# EAGLE design forcefoot (EAGLE 6.1)
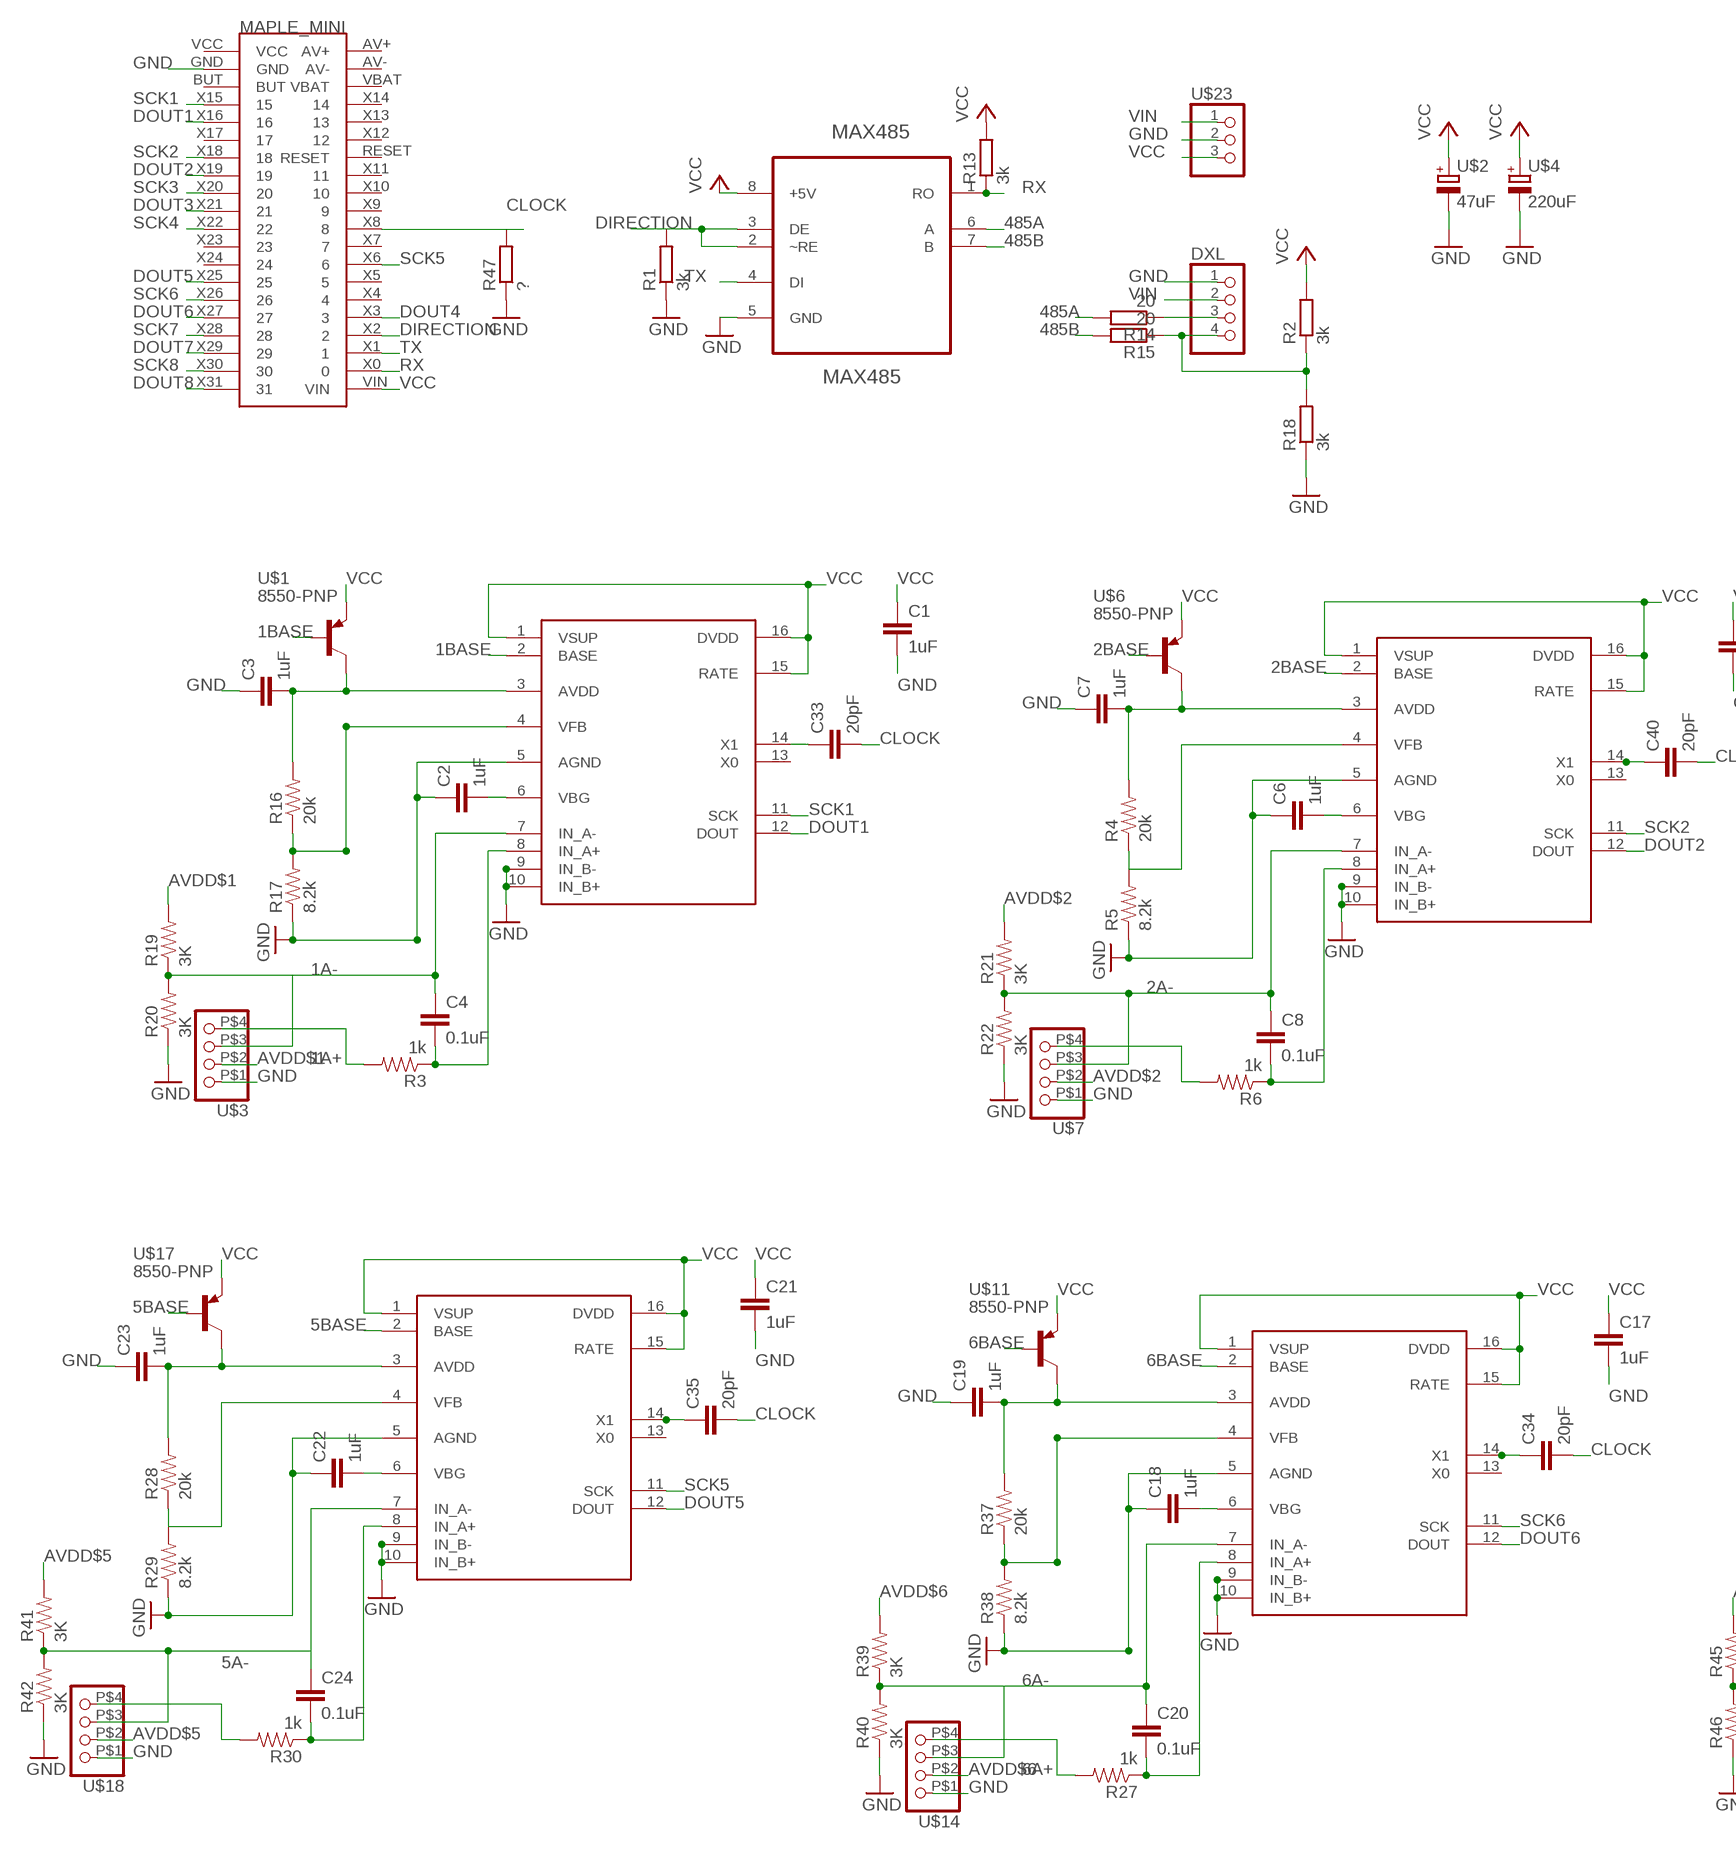
[diagram p0: schematic, sheet 1, part 1 of 2]
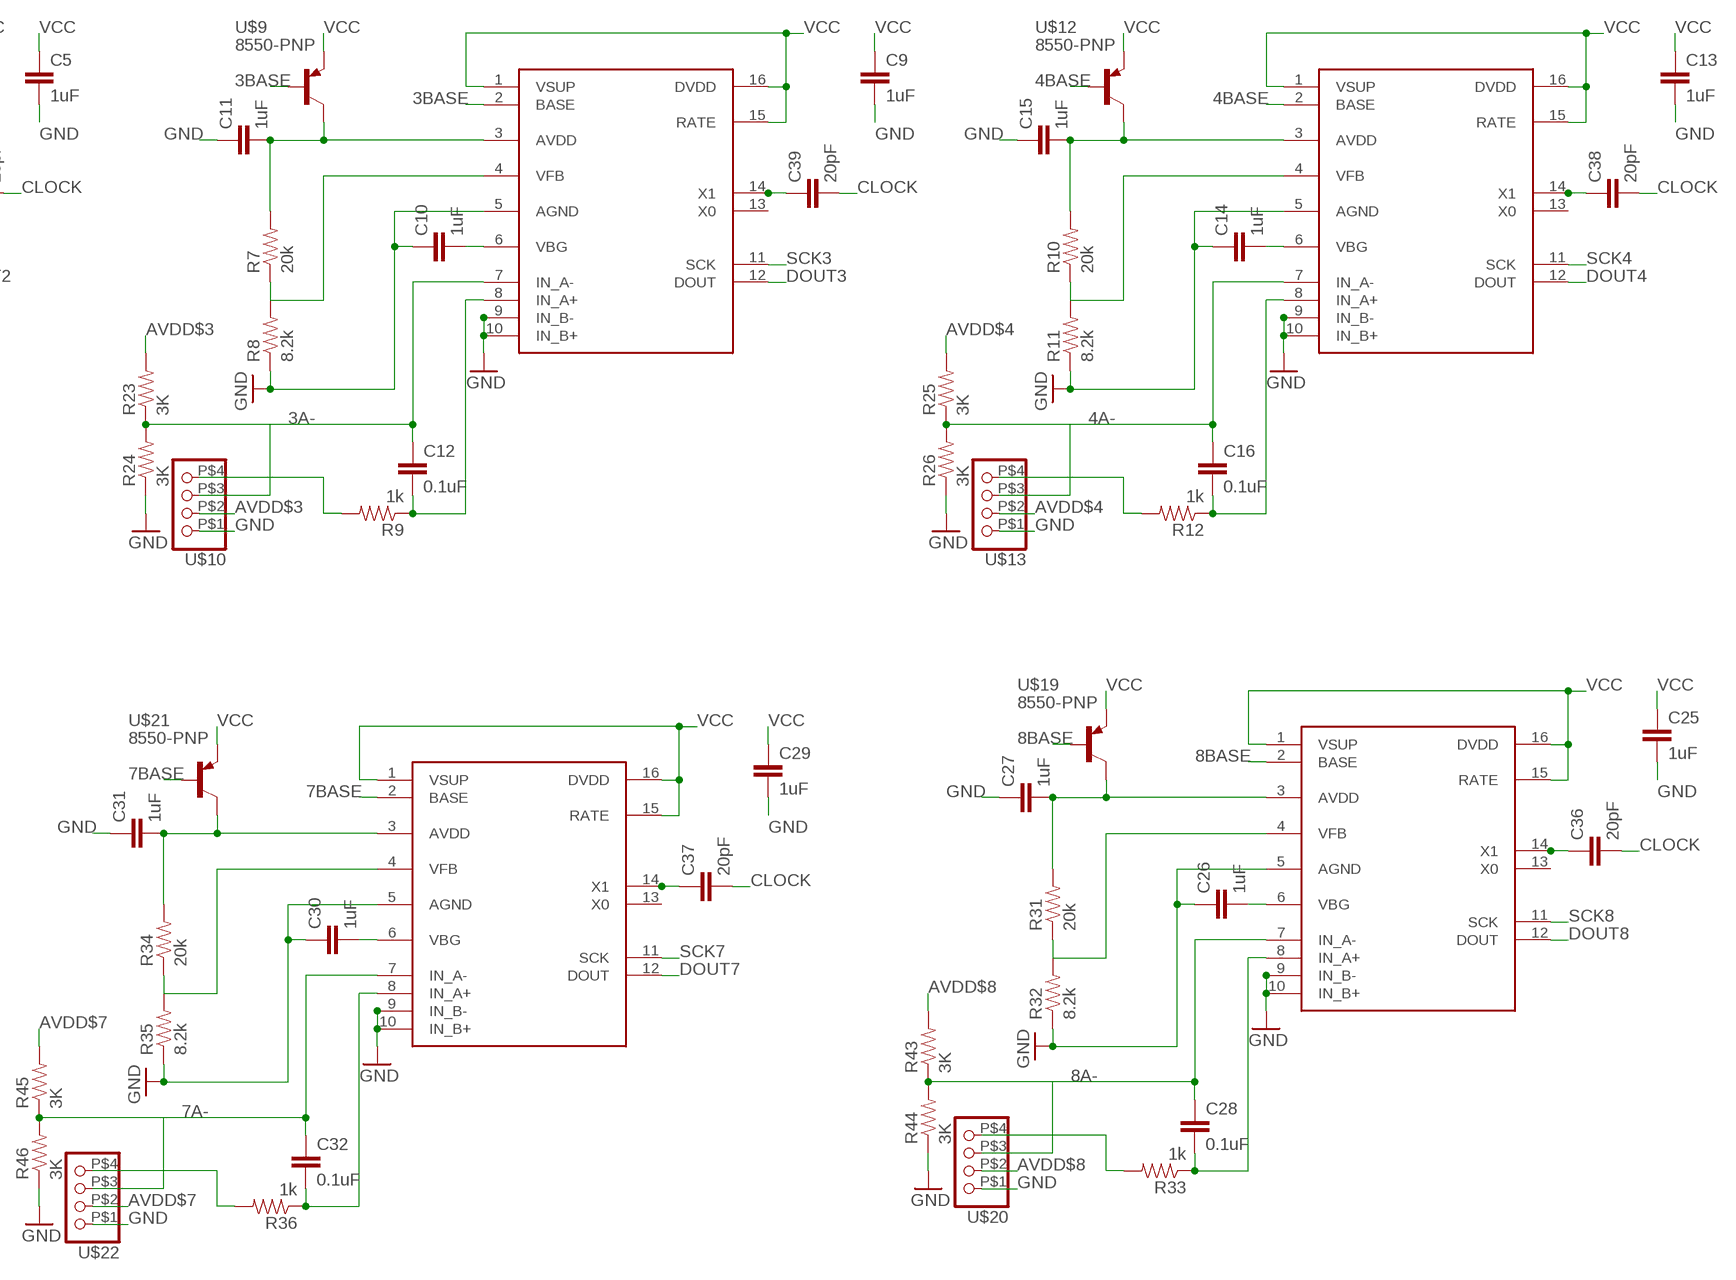
[diagram p1: schematic, sheet 1, part 2 of 2]

## Parts
C1  1uF  CAP0805  [0805]
C2  1uF  CAP0805  [0805]
C3  1uF  CAP0805  [0805]
C4  0.1uF  CAP0805  [0805]
C5  1uF  CAP0805  [0805]
C6  1uF  CAP0805  [0805]
C7  1uF  CAP0805  [0805]
C8  0.1uF  CAP0805  [0805]
C9  1uF  CAP0805  [0805]
C10  1uF  CAP0805  [0805]
C11  1uF  CAP0805  [0805]
C12  0.1uF  CAP0805  [0805]
C13  1uF  CAP0805  [0805]
C14  1uF  CAP0805  [0805]
C15  1uF  CAP0805  [0805]
C16  0.1uF  CAP0805  [0805]
C17  1uF  CAP0805  [0805]
C18  1uF  CAP0805  [0805]
C19  1uF  CAP0805  [0805]
C20  0.1uF  CAP0805  [0805]
C21  1uF  CAP0805  [0805]
C22  1uF  CAP0805  [0805]
C23  1uF  CAP0805  [0805]
C24  0.1uF  CAP0805  [0805]
C25  1uF  CAP0805  [0805]
C26  1uF  CAP0805  [0805]
C27  1uF  CAP0805  [0805]
C28  0.1uF  CAP0805  [0805]
C29  1uF  CAP0805  [0805]
C30  1uF  CAP0805  [0805]
C31  1uF  CAP0805  [0805]
C32  0.1uF  CAP0805  [0805]
C33  20pF  CAP0805  [0805]
C34  20pF  CAP0805  [0805]
C35  20pF  CAP0805  [0805]
C36  20pF  CAP0805  [0805]
C37  20pF  CAP0805  [0805]
C38  20pF  CAP0805  [0805]
C39  20pF  CAP0805  [0805]
C40  20pF  CAP0805  [0805]
DXL  CONNEC_1X04"  [CONNEC_1X04]
HX1  HX711SO16  [SO16]
HX2  HX711SO16  [SO16]
HX3  HX711SO16  [SO16]
HX4  HX711SO16  [SO16]
HX5  HX711SO16  [SO16]
HX6  HX711SO16  [SO16]
HX7  HX711SO16  [SO16]
HX8  HX711SO16  [SO16]
MAPLE_MINI  MAPLE_MINI  [CONNEC_2X20]
MAX485  MAX485  [SO8]
R1  3k  RESISTANCE-R0805  [R0805]
R2  3k  RESISTANCE-R0805  [R0805]
R3  1k  RESISTOR0805-RES  [0805]
R4  20k  RESISTOR0805-RES  [0805]
R5  8.2k  RESISTOR0805-RES  [0805]
R6  1k  RESISTOR0805-RES  [0805]
R7  20k  RESISTOR0805-RES  [0805]
R8  8.2k  RESISTOR0805-RES  [0805]
R9  1k  RESISTOR0805-RES  [0805]
R10  20k  RESISTOR0805-RES  [0805]
R11  8.2k  RESISTOR0805-RES  [0805]
R12  1k  RESISTOR0805-RES  [0805]
R13  3k  RESISTANCE-R0805  [R0805]
R14  20  RESISTANCE-R0805  [R0805]
R15  20  RESISTANCE-R0805  [R0805]
R16  20k  RESISTOR0805-RES  [0805]
R17  8.2k  RESISTOR0805-RES  [0805]
R18  3k  RESISTANCE-R0805  [R0805]
R19  3K  RESISTOR0805-RES  [0805]
R20  3K  RESISTOR0805-RES  [0805]
R21  3K  RESISTOR0805-RES  [0805]
R22  3K  RESISTOR0805-RES  [0805]
R23  3K  RESISTOR0805-RES  [0805]
R24  3K  RESISTOR0805-RES  [0805]
R25  3K  RESISTOR0805-RES  [0805]
R26  3K  RESISTOR0805-RES  [0805]
R27  1k  RESISTOR0805-RES  [0805]
R28  20k  RESISTOR0805-RES  [0805]
R29  8.2k  RESISTOR0805-RES  [0805]
R30  1k  RESISTOR0805-RES  [0805]
R31  20k  RESISTOR0805-RES  [0805]
R32  8.2k  RESISTOR0805-RES  [0805]
R33  1k  RESISTOR0805-RES  [0805]
R34  20k  RESISTOR0805-RES  [0805]
R35  8.2k  RESISTOR0805-RES  [0805]
R36  1k  RESISTOR0805-RES  [0805]
R37  20k  RESISTOR0805-RES  [0805]
R38  8.2k  RESISTOR0805-RES  [0805]
R39  3K  RESISTOR0805-RES  [0805]
R40  3K  RESISTOR0805-RES  [0805]
R41  3K  RESISTOR0805-RES  [0805]
R42  3K  RESISTOR0805-RES  [0805]
R43  3K  RESISTOR0805-RES  [0805]
R44  3K  RESISTOR0805-RES  [0805]
R45  3K  RESISTOR0805-RES  [0805]
R46  3K  RESISTOR0805-RES  [0805]
R47  ?  RESISTANCE-R0805  [R0805]
U$1  8550-PNP  [SOT-23]
U$2  47uF  CPOL_EUPANASONIC_D  [PANASONIC_D]
U$3  CONNEC_1X041.5  [4P1.5]
U$4  220uF  CPOL_EUPANASONIC_D8  [PANASONIC_D8]
U$6  8550-PNP  [SOT-23]
U$7  CONNEC_1X041.5  [4P1.5]
U$9  8550-PNP  [SOT-23]
U$10  CONNEC_1X041.5  [4P1.5]
U$11  8550-PNP  [SOT-23]
U$12  8550-PNP  [SOT-23]
U$13  CONNEC_1X041.5  [4P1.5]
U$14  CONNEC_1X041.5  [4P1.5]
U$17  8550-PNP  [SOT-23]
U$18  CONNEC_1X041.5  [4P1.5]
U$19  8550-PNP  [SOT-23]
U$20  CONNEC_1X041.5  [4P1.5]
U$21  8550-PNP  [SOT-23]
U$22  CONNEC_1X041.5  [4P1.5]
U$23  CONNEC_1X03  [CONNEC_1X03]

## Nets
1A+: R3.2 U$3.P$4
1A-: C4.1 HX1.7(IN_A-) R19.1 R20.2 U$3.P$3
1BASE: HX1.2(BASE) U$1.1(B)
2A-: C8.1 HX2.7(IN_A-) R21.1 R22.2 U$7.P$3
2BASE: HX2.2(BASE) U$6.1(B)
3A-: C12.1 HX3.7(IN_A-) R23.1 R24.2 U$10.P$3
3BASE: HX3.2(BASE) U$9.1(B)
4A-: C16.1 HX4.7(IN_A-) R25.1 R26.2 U$13.P$3
4BASE: HX4.2(BASE) U$12.1(B)
5A-: C24.1 HX6.7(IN_A-) R41.1 R42.2 U$18.P$3
5BASE: HX6.2(BASE) U$17.1(B)
6A+: R27.2 U$14.P$4
6A-: C20.1 HX5.7(IN_A-) R39.1 R40.2 U$14.P$3
6BASE: HX5.2(BASE) U$11.1(B)
7A-: C32.1 HX8.7(IN_A-) R45.1 R46.2 U$22.P$3
7BASE: HX8.2(BASE) U$21.1(B)
8A-: C28.1 HX7.7(IN_A-) R43.1 R44.2 U$20.P$3
8BASE: HX7.2(BASE) U$19.1(B)
485A: MAX485.6(A) R14.2
485B: MAX485.7(B) R15.2
AVDD$1: C3.2 HX1.3(AVDD) R16.2 R19.2 U$1.3(C) U$3.P$2
AVDD$2: C7.2 HX2.3(AVDD) R4.2 R21.2 U$6.3(C) U$7.P$2
AVDD$3: C11.2 HX3.3(AVDD) R7.2 R23.2 U$9.3(C) U$10.P$2
AVDD$4: C15.2 HX4.3(AVDD) R10.2 R25.2 U$12.3(C) U$13.P$2
AVDD$5: C23.2 HX6.3(AVDD) R28.2 R41.2 U$17.3(C) U$18.P$2
AVDD$6: C19.2 HX5.3(AVDD) R37.2 R39.2 U$11.3(C) U$14.P$2
AVDD$7: C31.2 HX8.3(AVDD) R34.2 R45.2 U$21.3(C) U$22.P$2
AVDD$8: C27.2 HX7.3(AVDD) R31.2 R43.2 U$19.3(C) U$20.P$2
CLOCK: C33.2 C34.2 C35.2 C36.2 C37.2 C38.2 C39.2 C40.2 MAPLE_MINI.X8 R47.2
DIRECTION: MAPLE_MINI.X2 MAX485.2(~RE) MAX485.3(DE) R1.2
DOUT1: HX1.12(DOUT) MAPLE_MINI.X16
DOUT2: HX2.12(DOUT) MAPLE_MINI.X19
DOUT3: HX3.12(DOUT) MAPLE_MINI.X21
DOUT4: HX4.12(DOUT) MAPLE_MINI.X3
DOUT5: HX6.12(DOUT) MAPLE_MINI.X25
DOUT6: HX5.12(DOUT) MAPLE_MINI.X27
DOUT7: HX8.12(DOUT) MAPLE_MINI.X29
DOUT8: HX7.12(DOUT) MAPLE_MINI.X31
GND: C1.2 C2.1 C3.1 C5.2 C6.1 C7.1 C9.2 C10.1 C11.1 C13.2 C14.1 C15.1 C17.2 C18.1 C19.1 C21.2 C22.1 C23.1 C25.2 C26.1 C27.1 C29.2 C30.1 C31.1 DXL.1 HX1.5(AGND) HX1.9(IN_B-) HX1.10(IN_B+) HX2.5(AGND) HX2.9(IN_B-) HX2.10(IN_B+) HX3.5(AGND) HX3.9(IN_B-) HX3.10(IN_B+) HX4.5(AGND) HX4.9(IN_B-) HX4.10(IN_B+) HX5.5(AGND) HX5.9(IN_B-) HX5.10(IN_B+) HX6.5(AGND) HX6.9(IN_B-) HX6.10(IN_B+) HX7.5(AGND) HX7.9(IN_B-) HX7.10(IN_B+) HX8.5(AGND) HX8.9(IN_B-) HX8.10(IN_B+) MAPLE_MINI.GND MAX485.5(GND) R1.1 R5.1 R8.1 R11.1 R17.1 R18.1 R20.1 R22.1 R24.1 R26.1 R29.1 R32.1 R35.1 R38.1 R40.1 R42.1 R44.1 R46.1 R47.1 U$2.- U$3.P$1 U$4.- U$7.P$1 U$10.P$1 U$13.P$1 U$14.P$1 U$18.P$1 U$20.P$1 U$22.P$1 U$23.2
INAP$1: C4.2 HX1.8(IN_A+) R3.1
INAP$2: C8.2 HX2.8(IN_A+) R6.1
INAP$3: C12.2 HX3.8(IN_A+) R9.1
INAP$4: C16.2 HX4.8(IN_A+) R12.1
INAP$5: C20.2 HX5.8(IN_A+) R27.1
INAP$6: C24.2 HX6.8(IN_A+) R30.1
INAP$7: C28.2 HX7.8(IN_A+) R33.1
INAP$8: C32.2 HX8.8(IN_A+) R36.1
N$1: C2.2 HX1.6(VBG)
N$2: C18.2 HX5.6(VBG)
N$3: C6.2 HX2.6(VBG)
N$4: R6.2 U$7.P$4
N$5: C10.2 HX3.6(VBG)
N$6: R9.2 U$10.P$4
N$7: C14.2 HX4.6(VBG)
N$8: R12.2 U$13.P$4
N$9: C22.2 HX6.6(VBG)
N$10: R30.2 U$18.P$4
N$11: C26.2 HX7.6(VBG)
N$12: R33.2 U$20.P$4
N$13: C30.2 HX8.6(VBG)
N$14: R36.2 U$22.P$4
N$16: C33.1 HX1.14(X1)
N$17: C34.1 HX5.14(X1)
N$18: C35.1 HX6.14(X1)
N$19: C36.1 HX7.14(X1)
N$20: C37.1 HX8.14(X1)
N$21: C38.1 HX4.14(X1)
N$22: C39.1 HX3.14(X1)
N$23: C40.1 HX2.14(X1)
RS+: DXL.3 R14.1
RS-: DXL.4 R2.1 R15.1 R18.2
RX: MAPLE_MINI.X0 MAX485.1(RO) R13.1
SCK1: HX1.11(SCK) MAPLE_MINI.X15
SCK2: HX2.11(SCK) MAPLE_MINI.X18
SCK3: HX3.11(SCK) MAPLE_MINI.X20
SCK4: HX4.11(SCK) MAPLE_MINI.X22
SCK5: HX6.11(SCK) MAPLE_MINI.X6
SCK6: HX5.11(SCK) MAPLE_MINI.X26
SCK7: HX8.11(SCK) MAPLE_MINI.X28
SCK8: HX7.11(SCK) MAPLE_MINI.X30
TX: MAPLE_MINI.X1 MAX485.4(DI)
VCC: C1.1 C5.1 C9.1 C13.1 C17.1 C21.1 C25.1 C29.1 HX1.1(VSUP) HX1.15(RATE) HX1.16(DVDD) HX2.1(VSUP) HX2.15(RATE) HX2.16(DVDD) HX3.1(VSUP) HX3.15(RATE) HX3.16(DVDD) HX4.1(VSUP) HX4.15(RATE) HX4.16(DVDD) HX5.1(VSUP) HX5.15(RATE) HX5.16(DVDD) HX6.1(VSUP) HX6.15(RATE) HX6.16(DVDD) HX7.1(VSUP) HX7.15(RATE) HX7.16(DVDD) HX8.1(VSUP) HX8.15(RATE) HX8.16(DVDD) MAPLE_MINI.VIN MAX485.8(+5V) R2.2 R13.2 U$1.2(E) U$2.+ U$4.+ U$6.2(E) U$9.2(E) U$11.2(E) U$12.2(E) U$17.2(E) U$19.2(E) U$21.2(E) U$23.3
VFB$1: HX1.4(VFB) R16.1 R17.2
VFB$2: HX2.4(VFB) R4.1 R5.2
VFB$3: HX3.4(VFB) R7.1 R8.2
VFB$4: HX4.4(VFB) R10.1 R11.2
VFB$5: HX5.4(VFB) R37.1 R38.2
VFB$6: HX6.4(VFB) R28.1 R29.2
VFB$7: HX7.4(VFB) R31.1 R32.2
VFB$8: HX8.4(VFB) R34.1 R35.2
VIN: DXL.2 U$23.1
Unconnected: HX1.13(X0) HX2.13(X0) HX3.13(X0) HX4.13(X0) HX5.13(X0) HX6.13(X0) HX7.13(X0) HX8.13(X0) MAPLE_MINI.AV+ MAPLE_MINI.AV- MAPLE_MINI.BUT MAPLE_MINI.RESET MAPLE_MINI.VBAT MAPLE_MINI.VCC MAPLE_MINI.X4 MAPLE_MINI.X5 MAPLE_MINI.X7 MAPLE_MINI.X9 MAPLE_MINI.X10 MAPLE_MINI.X11 MAPLE_MINI.X12 MAPLE_MINI.X13 MAPLE_MINI.X14 MAPLE_MINI.X17 MAPLE_MINI.X23 MAPLE_MINI.X24

## Library data of the parts
C1-C40 = SparkFun-Passives:CAP: Capacitor Standard 0603 ceramic capacitor, and 0.1" leaded capacitor.
DXL U$3 U$7 U$10 U$13 U$14 U$18 U$20 U$22 = rhoban:CONNEC_1X04
HX1-HX8 = rhoban:HX711
MAPLE_MINI = rhoban:MAPLE_MINI
MAX485 = rhoban:MAX485; DATASHEET: max485.pdf; DESCRIPTION: ±15kV ESD-Protected, Slew-Rate-Limited, Low-Power, RS-485/RS-422 Transceivers; FARNELL_LINK: http://fr.farnell.com/maxim-integrated-products/max485eesa/transceiver-rs-485-422-cms/dp/1379973?Ntt=1379973; MPN: MAX485EESA+; OC_FARNELL: 1379973; OC_NEWARK: 68K4798; PACKAGE: SOIC-8; SUPPLIER: Maxim
R1 R2 R13-R15 R18 R47 = rhoban:RESISTANCE: RESISTOR, European symbol
R3-R12 R16 R17 R19-R46 = SparkFun-Passives:RESISTOR: Resistor Basic schematic elements and footprints for 0603, 1206, and PTH resistors.
U$1 U$6 U$9 U$11 U$12 U$17 U$19 U$21 = rhoban:8550-PNP
U$2 U$4 = rhoban:CPOL_EU: 680 uF 16 V : http://fr.farnell.com/panasonic/eeufr1c681l/condensateur-radial-16v-680uf/dp/1800635 680 uF 25 V : http://fr.farnell.com/panasonic/eeufr1e681l/capacitor-radial-25v-680uf-20/dp/2063069 330 uF 25 V : http://fr.farnell.com/panasonic/eeufr1e331/condensateur-radial-25v-330uf/dp/1800648?Ntt=eeufr1e331
U$23 = rhoban:CONNEC_1X03

## Net classes
1 power: width 0.254 mm, drill 0.254 mm

## Board
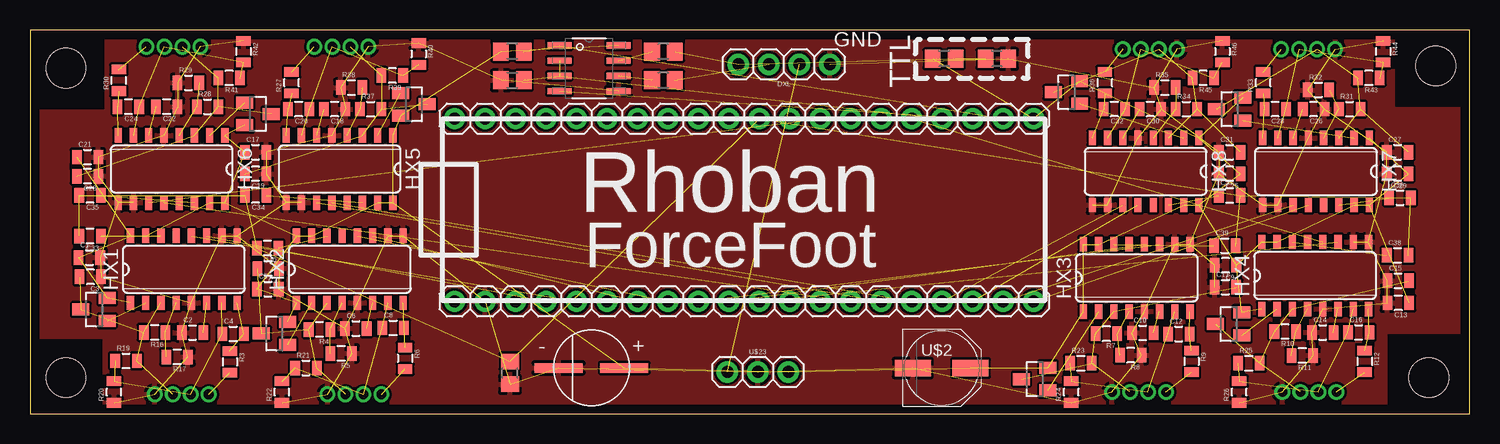
[diagram p2: board, top side]
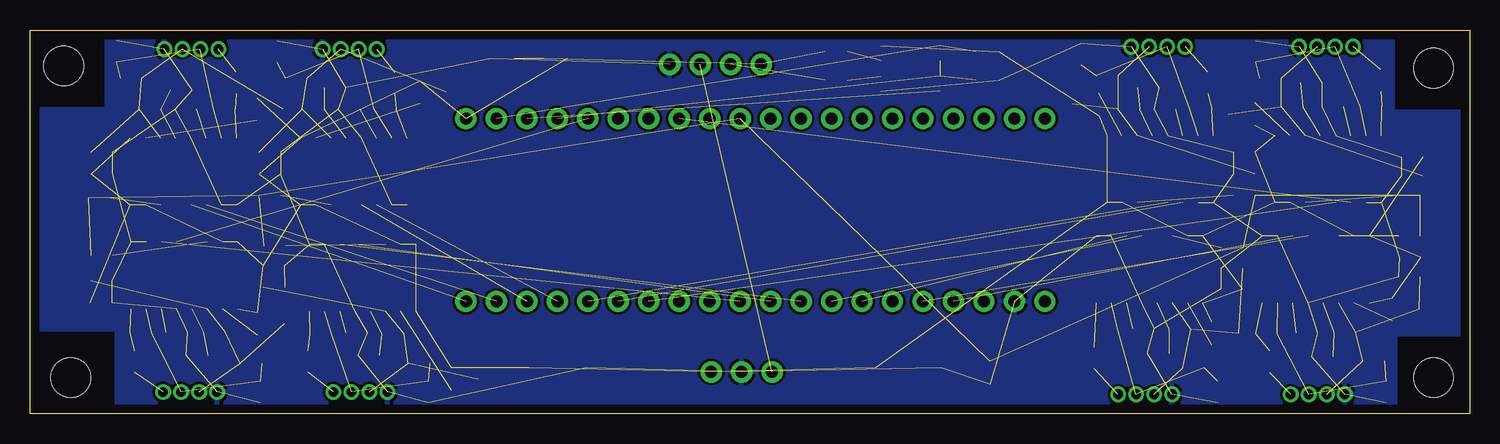
[diagram p3: board, bottom side, seen from below]

Size 120 x 32 mm. Coordinates in mm from the lower left corner, seen from the top.
Outline: 0,0 120,0 120,32 0,32 0,0
Copper layers (1*16): Top 0.035mm / dielectric 1.5mm / Bottom 0.035mm
Design rules: minimum track width 10mil, minimum drill 24mil, track to track 8mil, track to pad 8mil, pad to pad 8mil, via to via 8mil, smd to smd 8mil, copper to edge 30mil, drill to drill 8mil, minimum pad ring 10mil, minimum via ring 8mil, stop-mask expansion 4mil, vias tented up to drill 0mil, thermal gap 10mil
tRestrict: area -0.4,25.4 to 6.2,32.4; area -0.4,-0.2 to 6,6.2; area 113.2,0.2 to 120.4,6.6; area 113.8,25.6 to 120.4,31.8
bRestrict: area 113.8,25.6 to 120.4,31.8; area 113,0.4 to 120.2,6.8; area -0.4,0 to 6,6.4; area -0.4,25.4 to 6.2,32.2

### Footprints (pad centres in the part's own frame; a part is rotated, then mirrored left to right if it is on the bottom)
0805 = smd 0.8 x 1.2: 1 -0.9,0; 2 0.9,0
CONNEC_1X04 = drill 1 pad 1.778: 1 -1.27,1.27; 2 1.27,1.27; 3 3.81,1.27; 4 6.35,1.27
SO16 = smd 1.2 x 0.6: 1 -2.8,4.445; 2 -2.8,3.175; 3 -2.8,1.905; 4 -2.8,0.635; 5 -2.8,-0.635; 6 -2.8,-1.905; 7 -2.8,-3.175; 8 -2.8,-4.445; 9 2.8,-4.445; 10 2.8,-3.175; 11 2.8,-1.905; 12 2.8,-0.635; 13 2.8,0.635; 14 2.8,1.905; 15 2.8,3.175; 16 2.8,4.445
CONNEC_2X20 = drill 1 pad 1.778: AV+ 0,0; AV- 2.54,0; BUT 5.08,-15.24; GND 2.54,-15.24; RESET 15.24,0; VBAT 5.08,0; VCC 0,-15.24; VIN 48.26,0; X0 45.72,0; X1 43.18,0; X2 40.64,0; X3 38.1,0; X4 35.56,0; X5 33.02,0; X6 30.48,0; X7 27.94,0; X8 25.4,0; X9 22.86,0; X10 20.32,0; X11 17.78,0; X12 12.7,0; X13 10.16,0; X14 7.62,0; X15 7.62,-15.24; X16 10.16,-15.24; X17 12.7,-15.24; X18 15.24,-15.24; X19 17.78,-15.24; X20 20.32,-15.24; X21 22.86,-15.24; X22 25.4,-15.24; X23 27.94,-15.24; X24 30.48,-15.24; X25 33.02,-15.24; X26 35.56,-15.24; X27 38.1,-15.24; X28 40.64,-15.24; X29 43.18,-15.24; X30 45.72,-15.24; X31 48.26,-15.24
SO8 = smd 1.981 x 0.533: 1 -2.464,1.905; 2 -2.464,0.635; 3 -2.464,-0.635; 4 -2.464,-1.905; 5 2.464,-1.905; 6 2.464,-0.635; 7 2.464,0.635; 8 2.464,1.905
R0805 = smd 1.3 x 1.5: 1 -0.95,0; 2 0.95,0
SOT-23 = smd 1 x 1.4: 1 -0.95,-1.1; 2 0.95,-1.1; 3 0,1.1
PANASONIC_D = smd 3 x 1.4: + 2.4,0; - -2.4,0
4P1.5 = drill 0.8: P$1 0,0; P$2 1.5,0; P$3 3,0; P$4 4.5,0
PANASONIC_D8 = smd 4.016 x 0.8: + 2.73,0; - -2.73,0
STAND-OFF = hole 3.302: 0,0
CONNEC_1X03 = drill 1 pad 1.778: 1 -1.27,1.27; 2 1.27,1.27; 3 3.81,1.27

### Placement (x,y rotation side)
C1  4.95,13.01 0 top
C2  13.55,6.75 0 top
C3  5.03,11.41 180 top
C4  16.93,6.65 0 top
C5  19.83,10.39 0 top
C6  27.16,7.1 0 top
C7  19.85,12.09 180 top
C8  30.27,7.15 0 top
C9  99.66,12.36 180 top
C10  92.76,6.73 0 top
C11  99.65,10.54 0 top
C12  95.76,6.64 0 top
C13  114.06,9.23 180 top
C14  107.76,6.76 0 top
C15  114.05,11.07 0 top
C16  110.76,6.77 0 top
C17  18.8,21.8 0 top
C18  25.4,25.4 180 top
C19  18.8,20 180 top
C20  22.4,25.4 180 top
C21  4.8,21.4 0 top
C22  11.4,25.6 180 top
C23  4.8,19.8 180 top
C24  8.2,25.6 180 top
C25  100,20 180 top
C26  107,25.4 180 top
C27  114,21.8 0 top
C28  103.8,25.4 180 top
C29  114,20 180 top
C30  93.4,25.4 180 top
C31  100,21.8 0 top
C32  90.4,25.4 180 top
C33  5,14.8 180 top
C34  18.8,18.2 180 top
C35  5,18.2 180 top
C36  114.2,18 0 top
C37  100,18.2 0 top
C38  114,13.2 0 top
C39  99.6,14 0 top
C40  19.8,13.8 180 top
DXL  65.4,30.4 180 top
HX1  12.82,12.03 90 top
HX2  26.66,12.03 90 top
HX3  92.26,11.31 90 top
HX4  107.13,11.51 90 top
HX5  25.8,20.4 270 top
HX6  11.8,20.4 270 top
HX7  107.2,20.2 270 top
HX8  93,20.2 270 top
MAPLE_MINI  35.4,24.6 0 top
MAX485  46.6,28.8 0 top
R1  40.2,27.8 0 top
R2  76.2,29.6 180 top
R3  16.66,4.31 270 top
R4  24.13,7.01 180 top
R5  25.94,5.01 180 top
R6  31.27,4.61 270 top
R7  89.73,6.66 180 top
R8  91.76,4.87 180 top
R9  96.83,4.35 270 top
R10  104.63,6.83 180 top
R11  106.06,4.84 180 top
R12  111.26,4.35 270 top
R13  40.2,30.2 180 top
R14  52.8,27.8 180 top
R15  52.8,30.2 180 top
R16  10.39,6.76 180 top
R17  12.26,4.72 180 top
R18  80.6,29.6 180 top
R19  8,4.4 0 top
R20  7,1.8 90 top
R21  23,3.8 0 top
R22  21,1.8 90 top
R23  87.6,4.2 0 top
R24  86.8,1.8 90 top
R25  101.6,4.2 0 top
R26  100.8,1.8 90 top
R27  21.8,27.6 90 top
R28  14.8,25.6 0 top
R29  13.2,27.6 0 top
R30  7.4,27.8 90 top
R31  110,25.4 0 top
R32  107.4,27 0 top
R33  102.8,27.6 90 top
R34  96.4,25.4 0 top
R35  94.6,27.2 0 top
R36  89.6,27.6 90 top
R37  28.4,25.4 0 top
R38  26.8,27.2 0 top
R39  30.2,28.2 180 top
R40  32.4,30 270 top
R41  16.6,28 180 top
R42  17.8,30.2 270 top
R43  111.6,28 180 top
R44  112.8,30.2 270 top
R45  97.8,28 180 top
R46  99.4,30.2 270 top
R47  40,3.4 90 top
U$1  5.34,8.68 90 top
U$2  76,3.8 0 top
U$3  10.4,1.6 0 top
U$4  46.8,3.8 0 top
U$5  [STAND-OFF]  117.2,29 0 top
U$6  20.38,6.68 90 top
U$7  24.8,1.6 0 top
U$8  [STAND-OFF]  116.6,3 0 top
U$9  83.75,2.87 90 top
U$10  90.2,1.8 0 top
U$11  32,25.8 270 top
U$12  99.92,7.47 90 top
U$13  104.4,1.8 0 top
U$14  28.2,30.6 180 top
U$15  [STAND-OFF]  3,28.8 0 top
U$16  [STAND-OFF]  3,3 0 top
U$17  19,25 270 top
U$18  14.2,30.6 180 top
U$19  100,25.4 90 top
U$20  108.8,30.4 180 top
U$21  86.4,26.8 90 top
U$22  95.6,30.4 180 top
U$23  59.4,2.2 0 top

### Tracks (layer width: path | path; a pad name or v marks a point on that pad's centre or on a via)
1A+  (1 unrouted)
1A-  (4 unrouted)
1BASE  (1 unrouted)
2A-  (4 unrouted)
2BASE  (1 unrouted)
3A-  (4 unrouted)
3BASE  (1 unrouted)
4A-  (4 unrouted)
4BASE  (1 unrouted)
5A-  (4 unrouted)
5BASE  (1 unrouted)
6A+  (1 unrouted)
6A-  (4 unrouted)
6BASE  (1 unrouted)
7A-  (4 unrouted)
7BASE  (1 unrouted)
8A-  (4 unrouted)
8BASE  (1 unrouted)
485A  (1 unrouted)
485B  (1 unrouted)
AVDD$1  (5 unrouted)
AVDD$2  (5 unrouted)
AVDD$3  (5 unrouted)
AVDD$4  (5 unrouted)
AVDD$5  (5 unrouted)
AVDD$6  (5 unrouted)
AVDD$7  (5 unrouted)
AVDD$8  (5 unrouted)
CLOCK  (9 unrouted)
DIRECTION  (3 unrouted)
DOUT1  (1 unrouted)
DOUT2  (1 unrouted)
DOUT3  (1 unrouted)
DOUT4  (1 unrouted)
DOUT5  (1 unrouted)
DOUT6  (1 unrouted)
DOUT7  (1 unrouted)
DOUT8  (1 unrouted)
GND  (80 unrouted)
  pour Bottom: -1.2,41.6 135.8,41.6 135.8,-18.4 -5,-18.4 -5,26.6
  pour Top: -8,37.6 127.8,37.6 127.8,-15.4 -10.8,-15.4 -10.8,30.2
INAP$1  (2 unrouted)
INAP$2  (2 unrouted)
INAP$3  (2 unrouted)
INAP$4  (2 unrouted)
INAP$5  (2 unrouted)
INAP$6  (2 unrouted)
INAP$7  (2 unrouted)
INAP$8  (2 unrouted)
N$1  (1 unrouted)
N$2  (1 unrouted)
N$3  (1 unrouted)
N$4  (1 unrouted)
N$5  (1 unrouted)
N$6  (1 unrouted)
N$7  (1 unrouted)
N$8  (1 unrouted)
N$9  (1 unrouted)
N$10  (1 unrouted)
N$11  (1 unrouted)
N$12  (1 unrouted)
N$13  (1 unrouted)
N$14  (1 unrouted)
N$16  (1 unrouted)
N$17  (1 unrouted)
N$18  (1 unrouted)
N$19  (1 unrouted)
N$20  (1 unrouted)
N$21  (1 unrouted)
N$22  (1 unrouted)
N$23  (1 unrouted)
RS+  (1 unrouted)
RS-  (3 unrouted)
RX  (2 unrouted)
SCK1  (1 unrouted)
SCK2  (1 unrouted)
SCK3  (1 unrouted)
SCK4  (1 unrouted)
SCK5  (1 unrouted)
SCK6  (1 unrouted)
SCK7  (1 unrouted)
SCK8  (1 unrouted)
TX  (1 unrouted)
VCC  (46 unrouted)
VFB$1  (2 unrouted)
VFB$2  (2 unrouted)
VFB$3  (2 unrouted)
VFB$4  (2 unrouted)
VFB$5  (2 unrouted)
VFB$6  (2 unrouted)
VFB$7  (2 unrouted)
VFB$8  (2 unrouted)
VIN  (1 unrouted)

### Text on the board
_tsilk: GND | TTL | Rhoban | ForceFoot